# EAGLE design hollis_omnidrive (EAGLE 7.5.0)
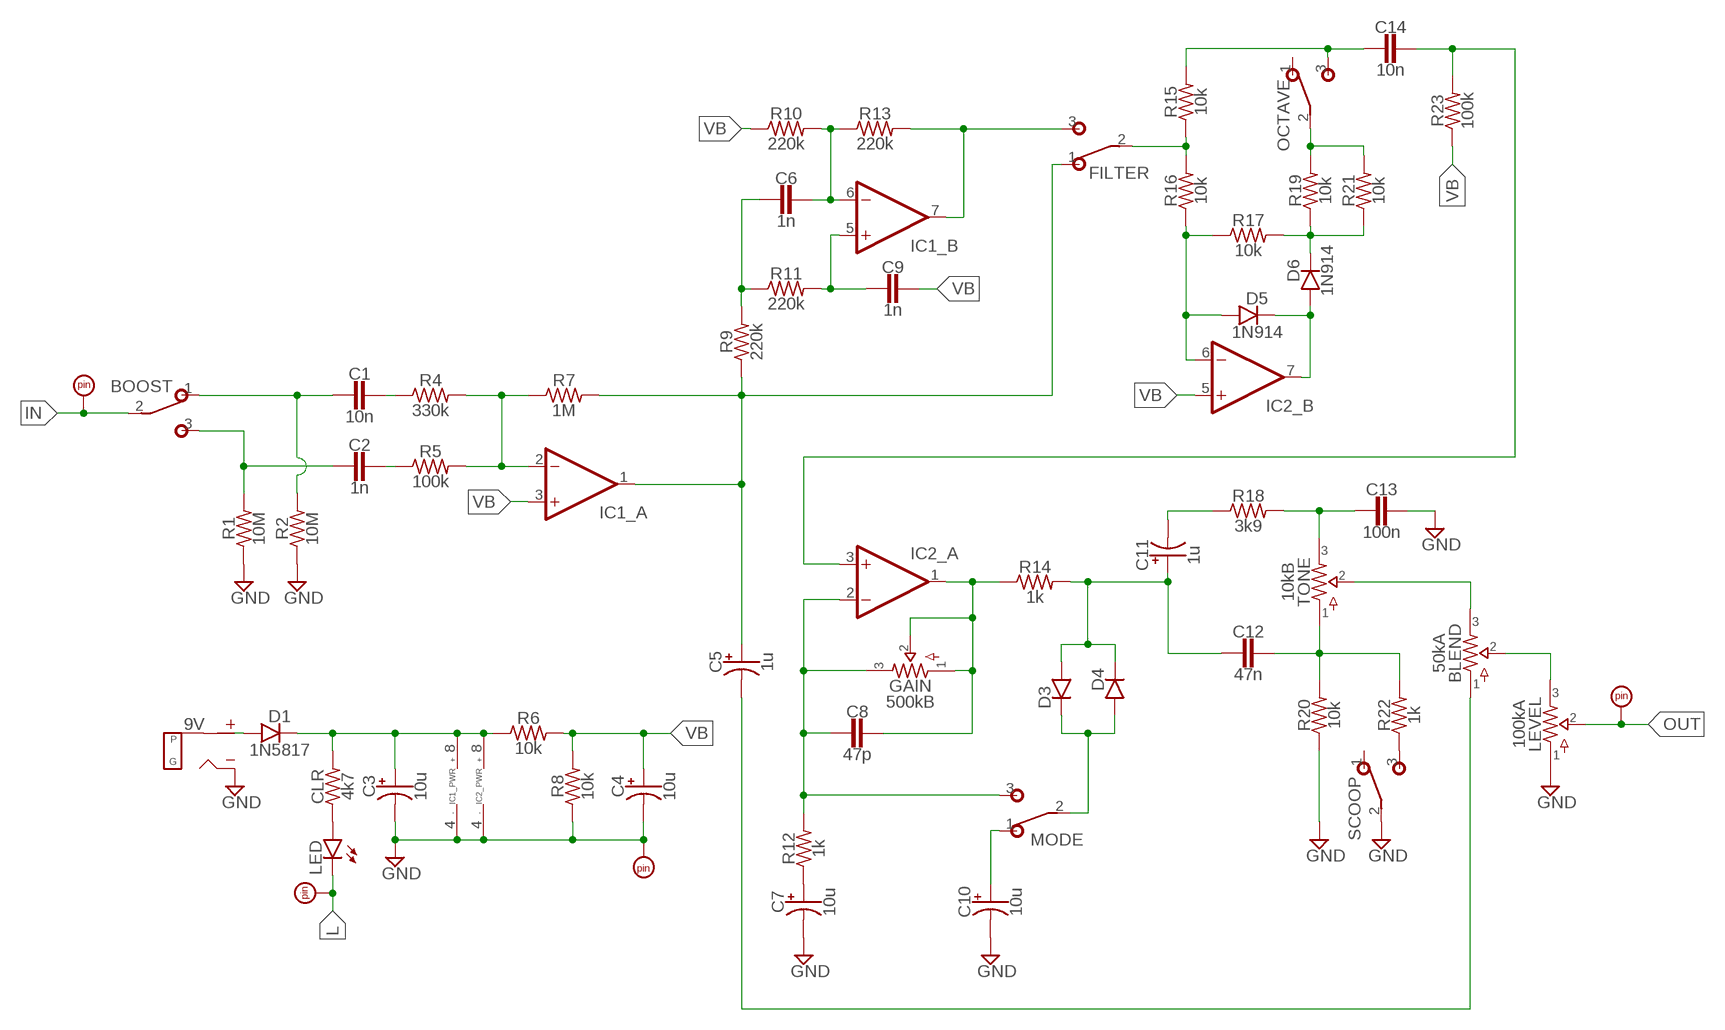
[diagram p0: schematic, sheet 1]

## Parts
9V  DC_MONO  [DC]
BLEND  50kA  POTS16MM  [16MM]
BOOST  SPDT  [M9040P]
C1  10n  CER/FILM2  [050X030_025_2]
C2  1n  CER/FILM2  [050X030_025_2]
C3  10u  0501  [050_020_1]
C4  10u  0501  [050_020_1]
C5  1u  0501  [050_020_1]
C6  1n  CER/FILM2  [050X030_025_2]
C7  10u  0501  [050_020_1]
C8  47p  CER/FILM2  [050X030_025_2]
C9  1n  CER/FILM2  [050X030_025_2]
C10  10u  0501  [050_020_1]
C11  1u  0501  [050_020_1]
C12  47n  CER/FILM2  [050X030_025_2]
C13  100n  CER/FILM2  [050X030_025_2]
C14  10n  CER/FILM2  [050X030_025_2]
CLR  4k7  R_.3B  [R0207/3]
D1  1N5817  DO41.3  [DO41-3]
D3  DO35.3  [DO35-3]
D4  DO35.3  [DO35-3]
D5  1N914  DO35.2  [DO35-2]
D6  1N914  DO35.2  [DO35-2]
FILTER  SPDT  [M9040P]
GAIN  500kB  POTS16MM  [16MM]
GND  PADRND  [ROUND]
IC1  DUALTH  [DIL08]
IC2  DUALTH  [DIL08]
IN  PADSQR  [SQUARE]
L  PADRND  [ROUND]
LED  LEDB  [3MM_B]
LEVEL  100kA  POTS16MM  [16MM]
MODE  SPDT  [M9040P]
OCTAVE  SPDT  [M9040P]
OUT  PADSQR  [SQUARE]
R1  10M  R_.3B  [R0207/3]
R2  10M  R_.3B  [R0207/3]
R4  330k  R_.3B  [R0207/3]
R5  100k  R_.3B  [R0207/3]
R6  10k  R_.3B  [R0207/3]
R7  1M  R_.3B  [R0207/3]
R8  10k  R_.3B  [R0207/3]
R9  220k  R_.3B  [R0207/3]
R10  220k  R_.3B  [R0207/3]
R11  220k  R_.3B  [R0207/3]
R12  1k  R_.3B  [R0207/3]
R13  220k  R_.3B  [R0207/3]
R14  1k  R_.3B  [R0207/3]
R15  10k  R_.3B  [R0207/3]
R16  10k  R_.3B  [R0207/3]
R17  10k  R_.3B  [R0207/3]
R18  3k9  R_.3B  [R0207/3]
R19  10k  R_.3B  [R0207/3]
R20  10k  R_.3B  [R0207/3]
R21  10k  R_.3B  [R0207/3]
R22  1k  R_.3B  [R0207/3]
R23  100k  R_.3B  [R0207/3]
SCOOP  SPDT  [M9040P]
TONE  10kB  POTS16MM  [16MM]

## Nets
GND: 9V.S(SLEEVE) C3.- C4.- C7.- C10.- C13.1 GND.1 IC1.4(_PWR:V-) IC2.4(_PWR:V-) LEVEL.1 R1.1 R2.1 R8.1 R20.1 SCOOP.2(P)
IN: BOOST.2(P) IN.1
L: L.1 LED.K(C)
MODE: D3.C D4.A MODE.2(P)
N$1: 9V.T(TIP) D1.A
N$2: C5.+ FILTER.1(O) IC1.1(_A:OUT) R7.2 R9.1
N$4: BOOST.1(O) C1.2 R2.2
N$5: C1.1 R4.1
N$6: C2.1 R5.1
N$7: IC1.2(_A:-IN) R4.2 R5.2 R7.1
N$8: C6.2 R9.2 R11.1
N$9: BOOST.3(S) C2.2 R1.2
N$10: FILTER.2(P) R15.1 R16.2
N$11: C6.1 IC1.6(_B:-IN) R10.2 R13.1
N$12: FILTER.3(S) IC1.7(_B:OUT) R13.2
N$13: D5.A IC2.6(_B:-IN) R16.1 R17.1
N$14: C9.1 IC1.5(_B:+IN) R11.2
N$15: C14.2 OCTAVE.3(S) R15.2
N$16: C3.+ CLR.2 D1.C IC1.8(_PWR:V+) IC2.8(_PWR:V+) R6.1
N$17: D5.C D6.A IC2.7(_B:OUT)
N$18: D6.C R17.2 R19.1 R21.1
N$19: C14.1 IC2.3(_A:+IN) R23.2
N$20: C8.2 GAIN.3 IC2.2(_A:-IN) MODE.3(S) R12.2
N$21: C8.1 GAIN.1 GAIN.2 IC2.1(_A:OUT) R14.1
N$22: C7.+ R12.1
N$23: BLEND.1 C5.-
N$24: C10.+ MODE.1(O)
N$25: C11.- R18.1
N$26: C13.2 R18.2 TONE.3
N$27: C12.1 R20.2 R22.2 TONE.1
N$28: BLEND.3 TONE.2
N$29: CLR.1 LED.A
N$30: R22.1 SCOOP.3(S)
N$31: BLEND.2 LEVEL.3
N$32: C11.+ C12.2 D3.A D4.C R14.2
OCTAVE: OCTAVE.2(P) R19.2 R21.2
OUT: LEVEL.2 OUT.1
VB: C4.+ C9.2 IC1.3(_A:+IN) IC2.5(_B:+IN) R6.2 R8.2 R10.1 R23.1
Unconnected: OCTAVE.1(O) SCOOP.1(O)

## Library data of the parts
9V = jacks:DC_MONO
BLEND GAIN LEVEL TONE = potentiometers:POTS
BOOST FILTER MODE OCTAVE SCOOP = switches:SPDT: TOGGLE SWITCH Marquardt
C1 C2 C6 C8 C9 C12-C14 = capacitors-film:CER/FILM: 47 - 120pF Xicon Ceramic Disc 2.5mm lead spacing
C3-C5 C7 C10 C11 = capacitors-elec:050: 0.22 - 100uF Xicon values at Mouser.com: 10V: 10 - 100uF; 16V: 2.2 - 47uF; 25V: 0.47 - 47uF; 50V: 0.22 - 22uF
CLR R1 R2 R4-R23 = resistors:R_
D1 = diodes:DO41: DO-41 Package Diodes: 1N4001 - 1N40019 Zener Diodes: 1N4728 - 1N4764
D3-D6 = diodes:DO35: DO-35 Package Diodes: 1N914
GND IN L OUT = supply pins:PAD
IC1 IC2 = integrated circuits:DUAL: OP AMP
LED = diodes:LED

## Board
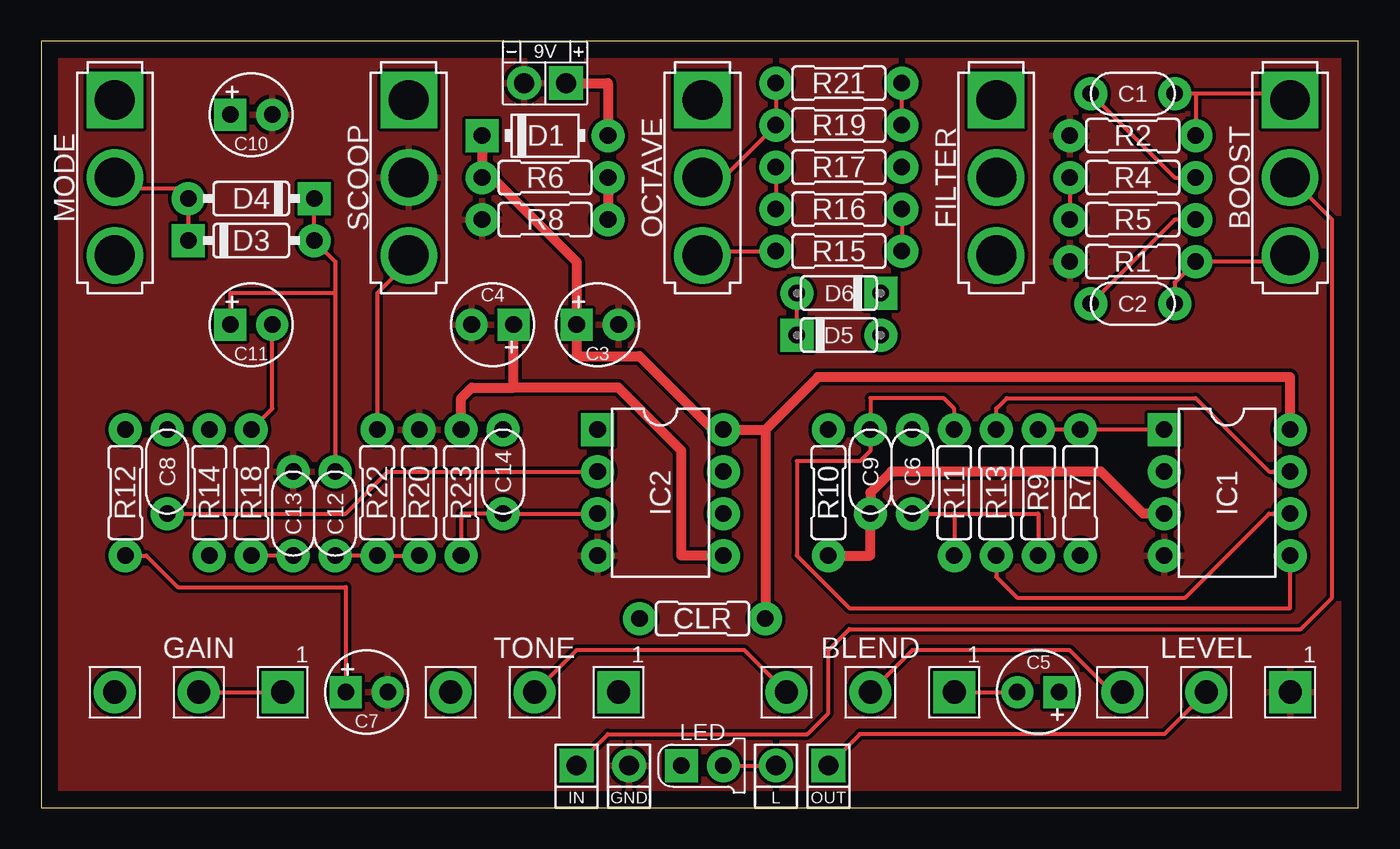
[diagram p1: board, top side]
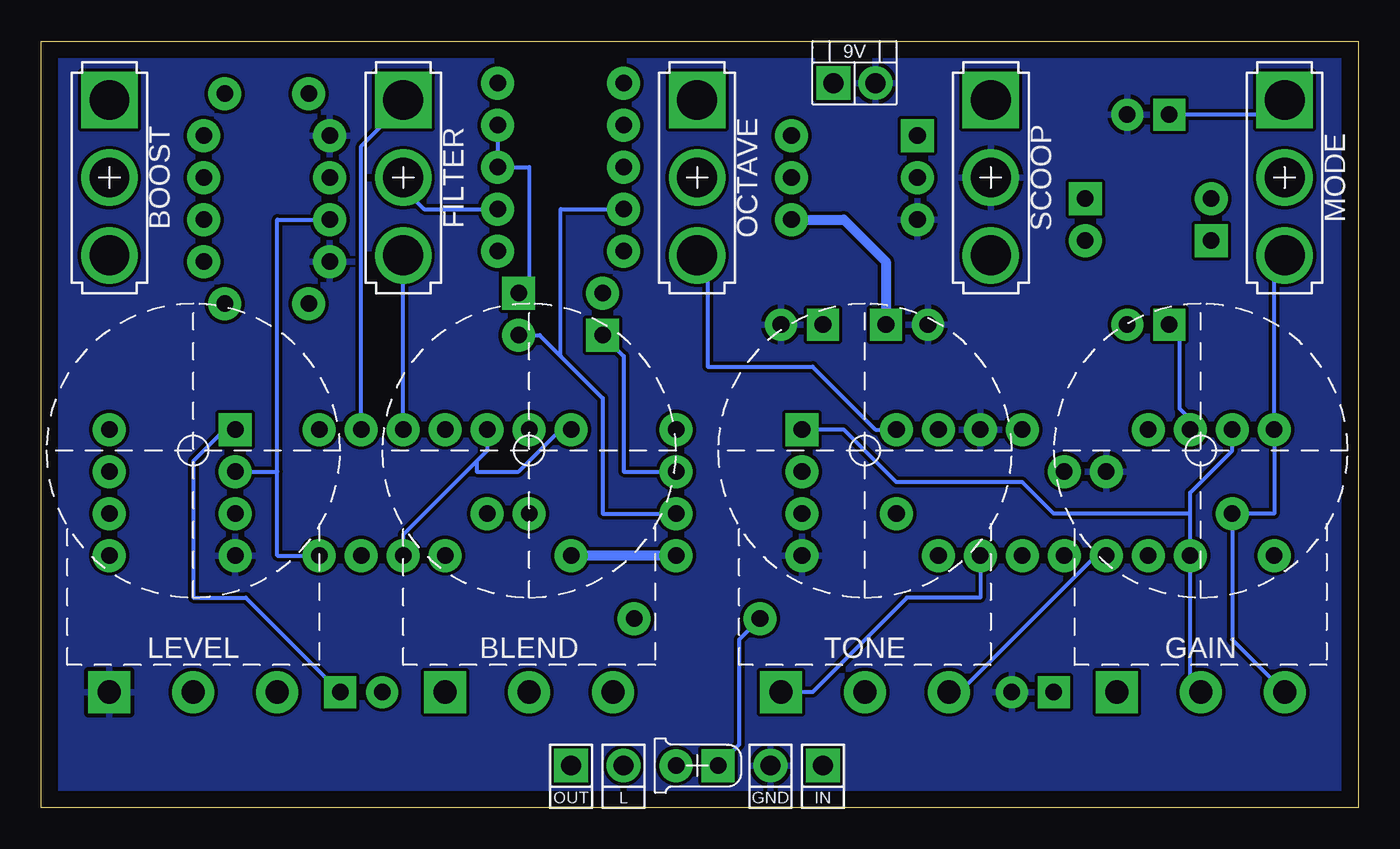
[diagram p2: board, bottom side, seen from below]

Size 79.68 x 46.34 mm. Coordinates in mm from the lower left corner, seen from the top.
Outline: 0,0 79.68,0 79.68,46.34 0,46.34 0,0
Copper layers (1*16): Top 0.035mm / dielectric 1.5mm / Bottom 0.035mm
Design rules "default": minimum track width 10mil, minimum drill 24mil, track to track 8mil, track to pad 8mil, pad to pad 8mil, via to via 8mil, smd to smd 8mil, copper to edge 40mil, drill to drill 8mil, minimum pad ring 10mil, minimum via ring 8mil, stop-mask expansion 4mil, vias tented up to drill 0mil, thermal gap 10mil

### Footprints (pad centres in the part's own frame; a part is rotated, then mirrored left to right if it is on the bottom)
DC = drill 1.2 pad 2.032: S -1.27,0 | drill 1.2 pad 2.032 square: T 1.27,0
16MM = drill 1.4 pad 2.54 square: 1 5.08,0 | drill 1.4 pad 2.54: 2 0,0; 3 -5.08,0
M9040P = drill 2.4 square: 1 4.699,0 | drill 2.4: 2 0,0; 3 -4.699,0
050X030_025_2 = drill 1 pad 2: 1 -2.54,0; 2 2.54,0
050_020_1 = drill 1 pad 1.93 square: + -1.27,0 | drill 1 pad 1.93: - 1.27,0
R0207/3 = drill 1 pad 2: 1 -3.81,0; 2 3.81,0
DO41-3 = drill 1 pad 2: A 3.81,0 | drill 1 pad 2 square: C -3.81,0
DO35-3 = drill 1 pad 2: A 3.81,0 | drill 1 pad 2 square: C -3.81,0
DO35-2 = drill 1 pad 2: A 2.54,0 | drill 1 pad 2 square: C -2.54,0
ROUND = drill 1.2 pad 2.032: 1 0,0
DIL08 = drill 1 pad 2 square: 1 -3.81,-3.81 | drill 1 pad 2: 2 -1.27,-3.81; 3 1.27,-3.81; 4 3.81,-3.81; 5 3.81,3.81; 6 1.27,3.81; 7 -1.27,3.81; 8 -3.81,3.81
SQUARE = drill 1.2 pad 2.032 square: 1 0,0
3MM_B = drill 1 pad 2 square: A -1.27,0 | drill 1 pad 2: K 1.27,0

### Placement (x,y rotation side)
9V  30.48,43.81 0 top
BLEND  50.16,6.99 0 top
BOOST  75.56,38.1 90 top
C1  66.04,43.18 0 top
C2  66.04,30.48 0 top
C3  33.66,29.21 0 top
C4  27.3,29.21 180 top
C5  60.33,6.99 180 top
C6  52.7,20.32 270 top
C7  19.68,6.99 0 top
C8  7.62,20.32 270 top
C9  50.16,20.32 270 top
C10  12.7,41.91 0 top
C11  12.7,29.21 0 top
C12  17.78,17.78 90 top
C13  15.24,17.78 270 top
C14  27.94,20.32 90 top
CLR  40.01,11.43 0 top
D1  30.48,40.64 0 top
D3  12.7,34.29 0 top
D4  12.7,36.83 180 top
D5  48.26,28.57 0 top
D6  48.26,31.11 180 top
FILTER  57.78,38.1 90 top
GAIN  9.53,6.99 0 top
GND  35.56,2.54 0 top
IC1  71.75,19.05 270 top
IC2  37.47,19.05 270 top
IN  32.38,2.54 0 top
L  44.45,2.54 0 top
LED  40.01,2.54 0 top
LEVEL  70.48,6.99 0 top
MODE  4.45,38.1 90 top
OCTAVE  40.01,38.1 90 top
OUT  47.62,2.54 0 top
R1  66.04,33.02 0 top
R2  66.04,40.64 0 top
R4  66.04,38.1 180 top
R5  66.04,35.56 180 top
R6  30.48,38.1 0 top
R7  62.87,19.05 90 top
R8  30.48,35.56 0 top
R9  60.33,19.05 270 top
R10  47.62,19.05 90 top
R11  55.24,19.05 90 top
R12  5.08,19.05 90 top
R13  57.78,19.05 90 top
R14  10.16,19.05 90 top
R15  48.26,33.66 180 top
R16  48.26,36.2 0 top
R17  48.26,38.73 0 top
R18  12.7,19.05 270 top
R19  48.26,41.27 180 top
R20  22.86,19.05 270 top
R21  48.26,43.81 180 top
R22  20.32,19.05 270 top
R23  25.4,19.05 270 top
SCOOP  22.23,38.1 90 top
TONE  29.84,6.99 0 top

### Tracks (layer width: path | path; a pad name or v marks a point on that pad's centre or on a via)
GND
  pour Top: 0,46.35 80.01,46.35 80.01,0.64 0,0.64
  pour Bottom: 0,46.35 80.01,46.35 80.01,0.64 0,0.64
IN
  Top 0.254: IN.1 34.29,4.45 46.35,4.45 47.62,5.71 47.62,9.53 48.9,10.79 76.2,10.79 78.11,12.7 78.11,35.56 BOOST.2
L
  Top 0.254: LED.K L.1
MODE
  Top 0.254: D3.C D4.A 8.26,37.47 5.08,37.47 MODE.2
N$1
  Top 0.61: 9V.T 34.29,43.81 D1.A
N$2
  Top 0.254: R9.1 R7.2 IC1.1
  Bottom 0.254: C5.+ 67.31,12.7 70.48,12.7 70.48,20.95 68.58,22.86 IC1.1 | R9.1 60.33,40.01 57.78,42.55 FILTER.1
N$4
  Top 0.254: 69.85,43.18 R2.2 | 69.85,43.18 75.56,43.18 BOOST.1 | 69.85,43.18 C1.2
N$5
  Top 0.254: R4.1 68.58,38.1 C1.1
N$6
  Top 0.254: C2.1 68.58,35.56 R5.1
N$7
  Top 0.254: R4.2 R5.2
  Bottom 0.254: R7.1 65.41,15.24 65.41,20.32 | R5.2 65.41,35.56 65.41,20.32 | IC1.2 65.41,20.32
N$8
  Top 0.254: 55.24,17.78 R11.1 | C6.2 55.24,17.78 | R9.2 60.33,17.78 55.24,17.78
N$9
  Top 0.254: C2.2 68.58,31.75 R1.2 75.56,33.02 BOOST.3
N$10
  Top 0.254: R16.2 R15.1
  Bottom 0.254: R16.2 56.52,36.2 57.78,37.47 FILTER.2
N$11
  Top 0.254: IC1.6 74.3,17.78 69.22,12.7 59.05,12.7 57.78,13.97 R13.1
  Bottom 0.254: R13.1 57.78,16.51 53.34,20.95 | 53.34,20.95 52.7,21.59 C6.1 | R10.2 48.26,22.86 50.8,20.32 53.34,20.32 53.34,20.95
N$12
  Top 0.254: IC1.7 74.3,20.32 69.85,24.77 58.42,24.77 57.78,24.13 R13.2
  Bottom 0.254: R13.2 FILTER.3
N$13
  Top 0.254: R17.1 R16.1
  Bottom 0.254: IC2.6 45.72,17.78 45.72,24.77 48.26,27.3 | 48.26,27.3 49.53,28.57 D5.A | R16.1 48.26,36.2 48.26,27.3
N$14
  Top 0.254: R11.2 55.24,24.13 54.61,24.77 50.16,24.77 C9.1 50.16,21.59 49.53,20.95 45.72,20.95 45.72,15.24 48.9,12.06 75.56,12.06 IC1.5
N$15
  Top 0.254: R15.2 40.01,33.66 OCTAVE.3
  Bottom 0.254: C14.2 29.21,22.86 33.02,26.67 39.37,26.67 39.37,32.38 40.01,33.02 OCTAVE.3
N$16
  Top 0.61: D1.C R6.1 27.3,38.1 32.38,33.02 C3.+ 32.38,27.3 36.2,27.3 40.64,22.86 IC2.8 43.81,22.86 | 43.81,22.86 CLR.2 | IC1.8 75.56,26.04 46.99,26.04 43.81,22.86
N$17
  Top 0.254: D5.C D6.A
  Bottom 0.254: IC2.7 44.45,20.32 44.45,27.3 D5.C
N$18
  Top 0.254: R19.1 R21.1
  Bottom 0.254: D6.C 50.16,31.11 50.16,38.73 R17.2 R19.1
N$19
  Top 0.254: R23.2 25.4,17.78 C14.1 IC2.3
N$20
  Top 0.254: IC2.2 20.95,20.32 18.41,17.78 C8.2
  Bottom 0.254: GAIN.3 7.62,10.16 C8.2 5.08,17.78 R12.2 5.08,32.38 4.45,33.02 MODE.3
N$21
  Top 0.254: GAIN.2 GAIN.1
  Bottom 0.254: GAIN.2 10.16,7.62 R14.1 10.16,17.78 | C8.1 7.62,21.59 10.16,19.05 10.16,17.78 | IC2.1 31.11,22.86 27.94,19.68 20.32,19.68 18.41,17.78 10.16,17.78
N$22
  Top 0.254: C7.+ 18.41,13.34 8.26,13.34 6.35,15.24 R12.1
N$23
  Top 0.254: BLEND.1 C5.-
N$24
  Bottom 0.254: C10.+ 4.45,41.91 MODE.1
N$25
  Top 0.254: C11.- 13.97,24.13 R18.1
N$26
  Top 0.254: C13.2 R18.2
  Bottom 0.254: C13.2 15.88,15.24 24.13,6.99 TONE.3
N$27
  Top 0.254: C12.1 R22.2 R20.2
  Bottom 0.254: TONE.1 33.02,6.99 27.3,12.7 22.86,12.7 R20.2
N$28
  Top 0.254: TONE.2 32.38,9.53 42.55,9.53 BLEND.3
N$29
  Bottom 0.254: LED.A 37.47,3.81 37.47,10.16 CLR.1
N$30
  Top 0.254: R22.1 20.32,31.11 22.23,33.02 SCOOP.3
N$31
  Top 0.254: BLEND.2 52.7,9.53 62.23,9.53 64.77,6.99 LEVEL.3
N$32
  Top 0.254: 17.78,31.11 17.78,33.02 D3.A D4.C | 17.78,31.11 C12.2 | C11.+ 11.43,31.11 17.78,31.11
  Bottom 0.254: C11.+ 10.79,28.57 10.79,24.13 10.16,23.5 R14.2
OCTAVE
  Top 0.254: R21.2 R19.2 41.27,38.1 OCTAVE.2
OUT
  Top 0.254: OUT.1 49.53,4.45 67.94,4.45 LEVEL.2
VB
  Top 0.61: R6.2 R8.2 | IC2.5 38.73,15.24 38.73,21.59 34.92,25.4 28.57,25.4 | 28.57,25.4 C4.+ | R23.1 25.4,24.77 26.04,25.4 28.57,25.4 | R10.1 50.16,15.24 C9.2 50.16,19.05 51.44,20.32 64.14,20.32 66.67,17.78 IC1.3
  Bottom 0.61: R8.2 31.11,35.56 28.57,33.02 C4.+ | IC2.5 R10.1